# Altium schematic sheet 26_PP0_SSMII.SchDoc
size 419 x 296 mm; Author: Serbinov O.A.; CompanyName: ELSICOM; DrawnBy: Serbinov O.A.; Engineer: Serbinov O.A.; Organization: Elsicom; Address1: Kirova avenue, 58; Address2: Tomsk; Address3: Russia 634012; DocumentNumber: 27; SheetNumber: 27; SheetTotal: 44; ProjectName: 48_PORTS
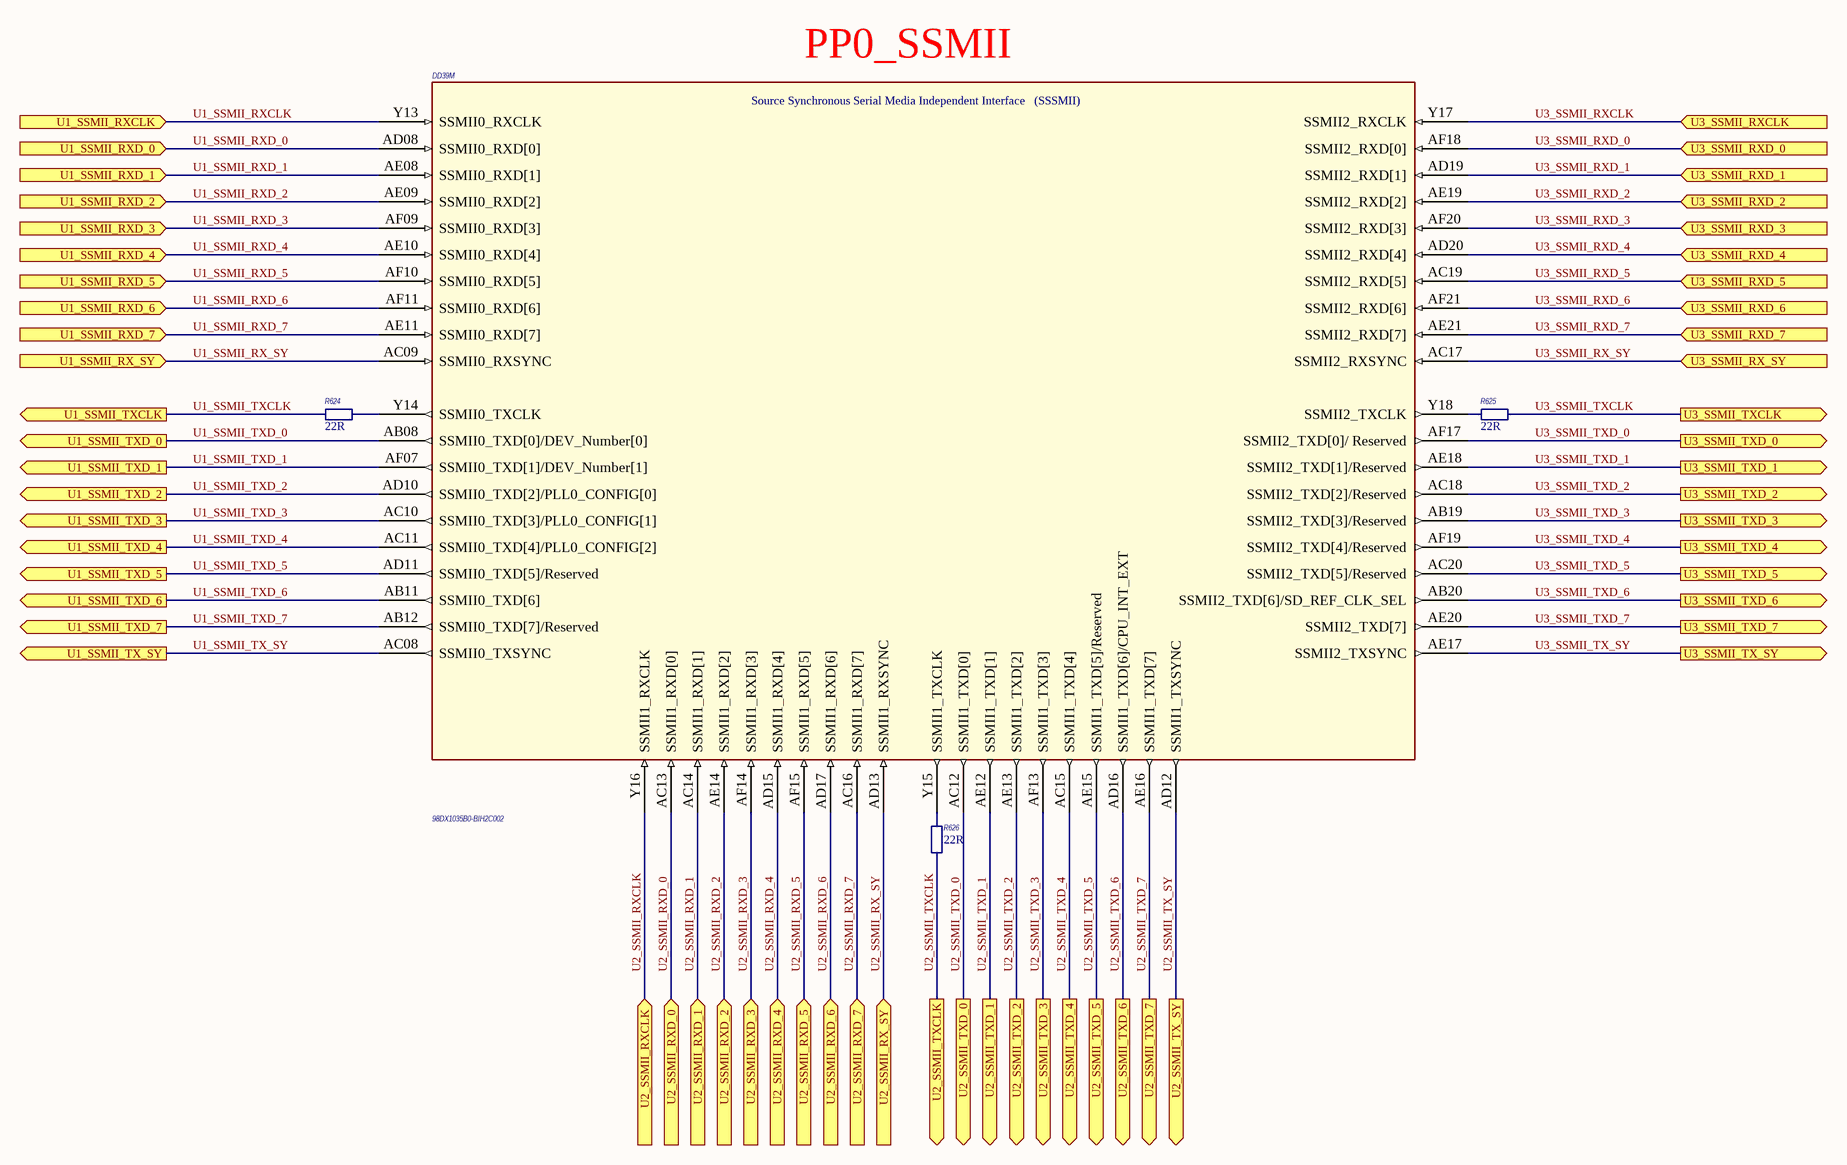
[diagram p0: 26_PP0_SSMII.SchDoc]

## Parts
DD39  98DX1035B0-BIH2C002  [HSBGA617_27X27_1MM]  (part M of 16)
R624  Resistance: 22R  [R0402_IPC High Density]  (hidden comment: ERJ-2RKF22R0X)
R625  Resistance: 22R  [R0402_IPC High Density]  (hidden comment: ERJ-2RKF22R0X)
R626  Resistance: 22R  [R0402_IPC High Density]  (hidden comment: ERJ-2RKF22R0X)

## Ports
U1_SSMII_RX_SY (in), U1_SSMII_RXCLK (in), U1_SSMII_RXD_0 (in), U1_SSMII_RXD_1 (in), U1_SSMII_RXD_2 (in), U1_SSMII_RXD_3 (in), U1_SSMII_RXD_4 (in), U1_SSMII_RXD_5 (in), U1_SSMII_RXD_6 (in), U1_SSMII_RXD_7 (in), U1_SSMII_TX_SY (out), U1_SSMII_TXCLK (out), U1_SSMII_TXD_0 (out), U1_SSMII_TXD_1 (out), U1_SSMII_TXD_2 (out), U1_SSMII_TXD_3 (out), U1_SSMII_TXD_4 (out), U1_SSMII_TXD_5 (out), U1_SSMII_TXD_6 (out), U1_SSMII_TXD_7 (out), U2_SSMII_RX_SY (in), U2_SSMII_RXCLK (in), U2_SSMII_RXD_0 (in), U2_SSMII_RXD_1 (in), U2_SSMII_RXD_2 (in), U2_SSMII_RXD_3 (in), U2_SSMII_RXD_4 (in), U2_SSMII_RXD_5 (in), U2_SSMII_RXD_6 (in), U2_SSMII_RXD_7 (in), U2_SSMII_TX_SY (out), U2_SSMII_TXCLK (out), U2_SSMII_TXD_0 (out), U2_SSMII_TXD_1 (out), U2_SSMII_TXD_2 (out), U2_SSMII_TXD_3 (out), U2_SSMII_TXD_4 (out), U2_SSMII_TXD_5 (out), U2_SSMII_TXD_6 (out), U2_SSMII_TXD_7 (out), U3_SSMII_RX_SY (in), U3_SSMII_RXCLK (in), U3_SSMII_RXD_0 (in), U3_SSMII_RXD_1 (in), U3_SSMII_RXD_2 (in), U3_SSMII_RXD_3 (in), U3_SSMII_RXD_4 (in), U3_SSMII_RXD_5 (in), U3_SSMII_RXD_6 (in), U3_SSMII_RXD_7 (in), U3_SSMII_TX_SY (out), U3_SSMII_TXCLK (out), U3_SSMII_TXD_0 (out), U3_SSMII_TXD_1 (out), U3_SSMII_TXD_2 (out), U3_SSMII_TXD_3 (out), U3_SSMII_TXD_4 (out), U3_SSMII_TXD_5 (out), U3_SSMII_TXD_6 (out), U3_SSMII_TXD_7 (out)

## Nets
U1_SSMII_RX_SY: DD39.AC09(SSMII0_RXSYNC) ; port U1_SSMII_RX_SY
U1_SSMII_RXCLK: DD39.Y13(SSMII0_RXCLK) ; port U1_SSMII_RXCLK
U1_SSMII_RXD_0: DD39.AD08(SSMII0_RXD[0]) ; port U1_SSMII_RXD_0
U1_SSMII_RXD_1: DD39.AE08(SSMII0_RXD[1]) ; port U1_SSMII_RXD_1
U1_SSMII_RXD_2: DD39.AE09(SSMII0_RXD[2]) ; port U1_SSMII_RXD_2
U1_SSMII_RXD_3: DD39.AF09(SSMII0_RXD[3]) ; port U1_SSMII_RXD_3
U1_SSMII_RXD_4: DD39.AE10(SSMII0_RXD[4]) ; port U1_SSMII_RXD_4
U1_SSMII_RXD_5: DD39.AF10(SSMII0_RXD[5]) ; port U1_SSMII_RXD_5
U1_SSMII_RXD_6: DD39.AF11(SSMII0_RXD[6]) ; port U1_SSMII_RXD_6
U1_SSMII_RXD_7: DD39.AE11(SSMII0_RXD[7]) ; port U1_SSMII_RXD_7
U1_SSMII_TX_SY: DD39.AC08(SSMII0_TXSYNC) ; port U1_SSMII_TX_SY
U1_SSMII_TXCLK: R624.2 ; port U1_SSMII_TXCLK
U1_SSMII_TXD_0: DD39.AB08(SSMII0_TXD[0]/DEV_Number[0]) ; port U1_SSMII_TXD_0
U1_SSMII_TXD_1: DD39.AF07(SSMII0_TXD[1]/DEV_Number[1]) ; port U1_SSMII_TXD_1
U1_SSMII_TXD_2: DD39.AD10(SSMII0_TXD[2]/PLL0_CONFIG[0]) ; port U1_SSMII_TXD_2
U1_SSMII_TXD_3: DD39.AC10(SSMII0_TXD[3]/PLL0_CONFIG[1]) ; port U1_SSMII_TXD_3
U1_SSMII_TXD_4: DD39.AC11(SSMII0_TXD[4]/PLL0_CONFIG[2]) ; port U1_SSMII_TXD_4
U1_SSMII_TXD_5: DD39.AD11(SSMII0_TXD[5]/Reserved) ; port U1_SSMII_TXD_5
U1_SSMII_TXD_6: DD39.AB11(SSMII0_TXD[6]) ; port U1_SSMII_TXD_6
U1_SSMII_TXD_7: DD39.AB12(SSMII0_TXD[7]/Reserved) ; port U1_SSMII_TXD_7
U2_SSMII_RX_SY: DD39.AD13(SSMII1_RXSYNC) ; port U2_SSMII_RX_SY
U2_SSMII_RXCLK: DD39.Y16(SSMII1_RXCLK) ; port U2_SSMII_RXCLK
U2_SSMII_RXD_0: DD39.AC13(SSMII1_RXD[0]) ; port U2_SSMII_RXD_0
U2_SSMII_RXD_1: DD39.AC14(SSMII1_RXD[1]) ; port U2_SSMII_RXD_1
U2_SSMII_RXD_2: DD39.AE14(SSMII1_RXD[2]) ; port U2_SSMII_RXD_2
U2_SSMII_RXD_3: DD39.AF14(SSMII1_RXD[3]) ; port U2_SSMII_RXD_3
U2_SSMII_RXD_4: DD39.AD15(SSMII1_RXD[4]) ; port U2_SSMII_RXD_4
U2_SSMII_RXD_5: DD39.AF15(SSMII1_RXD[5]) ; port U2_SSMII_RXD_5
U2_SSMII_RXD_6: DD39.AD17(SSMII1_RXD[6]) ; port U2_SSMII_RXD_6
U2_SSMII_RXD_7: DD39.AC16(SSMII1_RXD[7]) ; port U2_SSMII_RXD_7
U2_SSMII_TX_SY: DD39.AD12(SSMII1_TXSYNC) ; port U2_SSMII_TX_SY
U2_SSMII_TXCLK: R626.2 ; port U2_SSMII_TXCLK
U2_SSMII_TXD_0: DD39.AC12(SSMII1_TXD[0]) ; port U2_SSMII_TXD_0
U2_SSMII_TXD_1: DD39.AE12(SSMII1_TXD[1]) ; port U2_SSMII_TXD_1
U2_SSMII_TXD_2: DD39.AE13(SSMII1_TXD[2]) ; port U2_SSMII_TXD_2
U2_SSMII_TXD_3: DD39.AF13(SSMII1_TXD[3]) ; port U2_SSMII_TXD_3
U2_SSMII_TXD_4: DD39.AC15(SSMII1_TXD[4]) ; port U2_SSMII_TXD_4
U2_SSMII_TXD_5: DD39.AE15(SSMII1_TXD[5]/Reserved) ; port U2_SSMII_TXD_5
U2_SSMII_TXD_6: DD39.AD16(SSMII1_TXD[6]/CPU_INT_EXT) ; port U2_SSMII_TXD_6
U2_SSMII_TXD_7: DD39.AE16(SSMII1_TXD[7]) ; port U2_SSMII_TXD_7
U3_SSMII_RX_SY: DD39.AC17(SSMII2_RXSYNC) ; port U3_SSMII_RX_SY
U3_SSMII_RXCLK: DD39.Y17(SSMII2_RXCLK) ; port U3_SSMII_RXCLK
U3_SSMII_RXD_0: DD39.AF18(SSMII2_RXD[0]) ; port U3_SSMII_RXD_0
U3_SSMII_RXD_1: DD39.AD19(SSMII2_RXD[1]) ; port U3_SSMII_RXD_1
U3_SSMII_RXD_2: DD39.AE19(SSMII2_RXD[2]) ; port U3_SSMII_RXD_2
U3_SSMII_RXD_3: DD39.AF20(SSMII2_RXD[3]) ; port U3_SSMII_RXD_3
U3_SSMII_RXD_4: DD39.AD20(SSMII2_RXD[4]) ; port U3_SSMII_RXD_4
U3_SSMII_RXD_5: DD39.AC19(SSMII2_RXD[5]) ; port U3_SSMII_RXD_5
U3_SSMII_RXD_6: DD39.AF21(SSMII2_RXD[6]) ; port U3_SSMII_RXD_6
U3_SSMII_RXD_7: DD39.AE21(SSMII2_RXD[7]) ; port U3_SSMII_RXD_7
U3_SSMII_TX_SY: DD39.AE17(SSMII2_TXSYNC) ; port U3_SSMII_TX_SY
U3_SSMII_TXCLK: R625.1 ; port U3_SSMII_TXCLK
U3_SSMII_TXD_0: DD39.AF17(SSMII2_TXD[0]/_Reserved) ; port U3_SSMII_TXD_0
U3_SSMII_TXD_1: DD39.AE18(SSMII2_TXD[1]/Reserved) ; port U3_SSMII_TXD_1
U3_SSMII_TXD_2: DD39.AC18(SSMII2_TXD[2]/Reserved) ; port U3_SSMII_TXD_2
U3_SSMII_TXD_3: DD39.AB19(SSMII2_TXD[3]/Reserved) ; port U3_SSMII_TXD_3
U3_SSMII_TXD_4: DD39.AF19(SSMII2_TXD[4]/Reserved) ; port U3_SSMII_TXD_4
U3_SSMII_TXD_5: DD39.AC20(SSMII2_TXD[5]/Reserved) ; port U3_SSMII_TXD_5
U3_SSMII_TXD_6: DD39.AB20(SSMII2_TXD[6]/SD_REF_CLK_SEL) ; port U3_SSMII_TXD_6
U3_SSMII_TXD_7: DD39.AE20(SSMII2_TXD[7]) ; port U3_SSMII_TXD_7
NetDD39_Y14: DD39.Y14(SSMII0_TXCLK) R624.1
NetDD39_Y15: DD39.Y15(SSMII1_TXCLK) R626.1
NetDD39_Y18: DD39.Y18(SSMII2_TXCLK) R625.2

## Notes on the sheet
- (near DD39) PP0_SSMII
- A3
- SIZE
- PROJECT
- SHEET
- OF
- Engineer: Oleg Serbinov
- (in symbol 98DX1035A1-BIH2C002, part M) Source Synchronous Serial Media Independent Interface   (SSSMII)

## Library data of the parts
DD39 = 98DX1035A1-BIH2C002: IC 24-PORT FE  4-PORT 2.5GE L2 ENTRY-LEVEL, CPU; Customer Part Number: Микросхема, 98DX1035B0-BIH2C002, IC 24-PORT FE 4-PORT 2.5GE L2 ENTRY-LEVEL, HSBGA617SBGA617; Manufacturer: Marvell Technology Group; Manufacturer Part Number: 98DX1035B0-BIH2C002
R624-R626 = ERJ-2RKF22R0X: R0402, 22R 1%; Manufacturer: Panasonic; Rpart number: RC0402FR-0749R9L ; RC1005F49R9CS ; MCR01MRTF49R9 ; CRCW040249R9FKED ; CR0402-FX-49R9GLF ; RC-02W220FT; Rmanufacturer: Yageo  Samsung  Stackpole Electronics  Rohm Semiconductor  Vishay Dale; Customer Part Number: Резистор, 22R, 0402, 1%; Power Rating: 100; Voltage Rating: 50; Temperature Coefficient: ± 100; Resistor Element Material: Thick Film; Resistor Case Style: 0402; Resistor Mounting: SMD; Analogs: any suitable; Supplier 1: Farnell; Supplier Part Number 1: 2059106; RoHS 1: YES; Stock 1: 10948; Pricing 1: 50=0.016, 100=0.012, 500=0.006, 1000=0.004 (GBP); Resistance Tolerance: ± 1%; ComponentLink1URL: http://www.farnell.com/datasheets/426256.pdf; ComponentLink1Description: http://www.farnell.com/datasheets/426256.pdf; Supplier: Farnell; RoHS: YES; Manufacturer Part Number: ERJ-2RKF22R0X; Supplier Part Number: 2059106; Pricing: 50=0.016, 100=0.012, 500=0.006, 1000=0.004 (GBP)